# Altium schematic sheet Power.SchDoc
size A
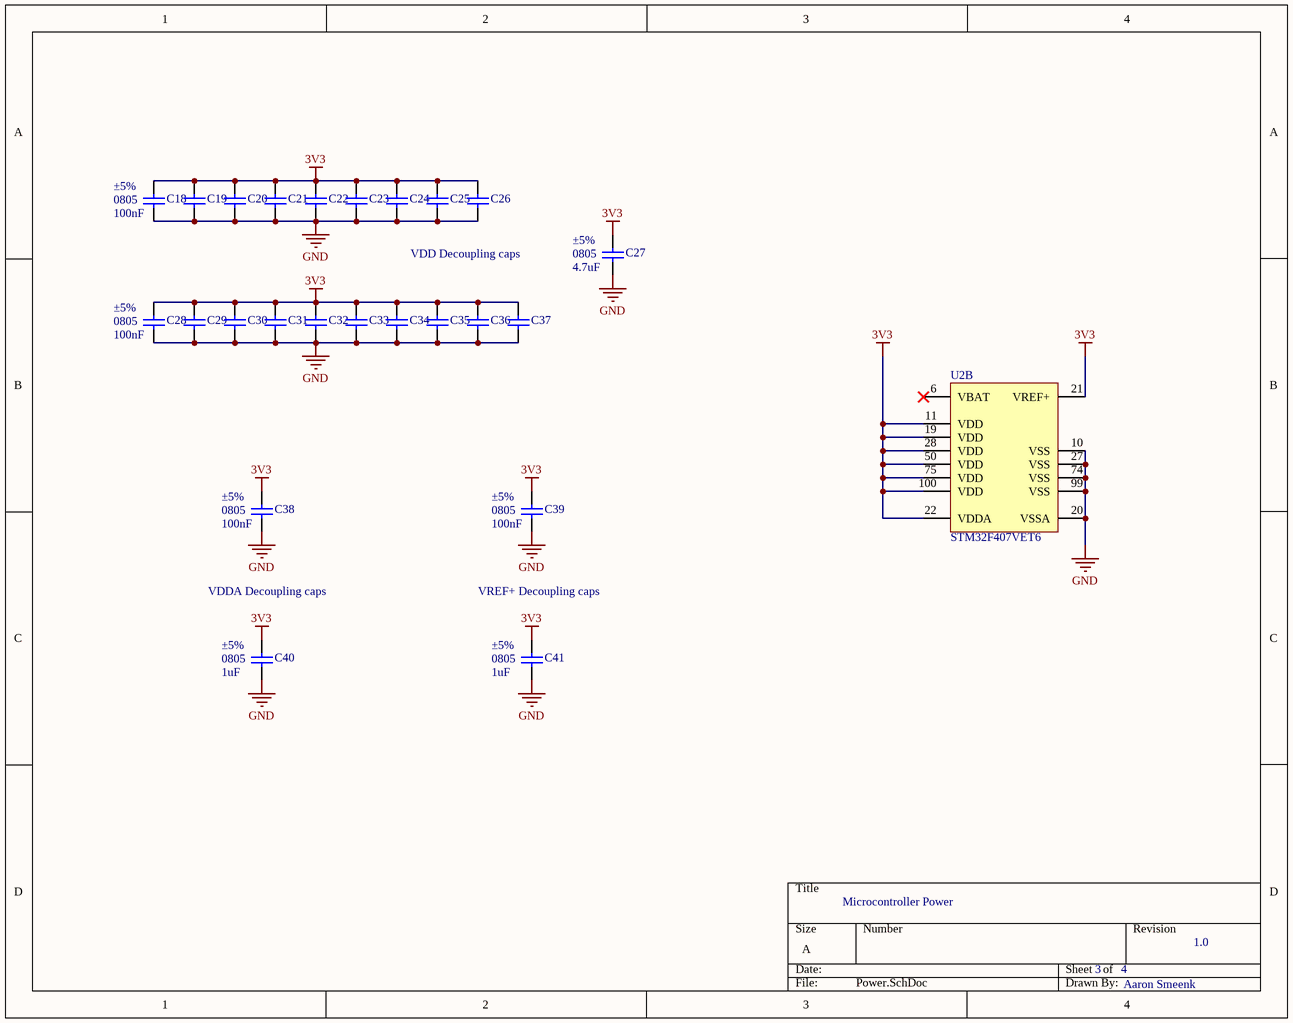
[diagram p0: Power.SchDoc]

## Parts
C18  value 100nF  Tolerance: ±5%  Case-EIA: 0805  [CAPC0805(2012)100_L]  (hidden comment: CAP 100nF 6.3V 0805(2012))
C19  CAP 100nF 6.3V 0805(2012)  [CAPC0805(2012)100_L]  (value not drawn)
C20  CAP 100nF 6.3V 0805(2012)  [CAPC0805(2012)100_L]  (value not drawn)
C21  CAP 100nF 6.3V 0805(2012)  [CAPC0805(2012)100_L]  (value not drawn)
C22  CAP 100nF 6.3V 0805(2012)  [CAPC0805(2012)100_L]  (value not drawn)
C23  CAP 100nF 6.3V 0805(2012)  [CAPC0805(2012)100_L]  (value not drawn)
C24  CAP 100nF 6.3V 0805(2012)  [CAPC0805(2012)100_L]  (value not drawn)
C25  CAP 100nF 6.3V 0805(2012)  [CAPC0805(2012)100_L]  (value not drawn)
C26  CAP 100nF 6.3V 0805(2012)  [CAPC0805(2012)100_L]  (value not drawn)
C27  value 4.7uF  Case-EIA: 0805  Tolerance: ±5%  [CAPC0805(2012)145_N]  (hidden comment: CAP 4.7uF 6.3V 0805(2012))
C28  value 100nF  Tolerance: ±5%  Case-EIA: 0805  [CAPC0805(2012)100_L]  (hidden comment: CAP 100nF 6.3V 0805(2012))
C29  CAP 100nF 6.3V 0805(2012)  [CAPC0805(2012)100_L]  (value not drawn)
C30  CAP 100nF 6.3V 0805(2012)  [CAPC0805(2012)100_L]  (value not drawn)
C31  CAP 100nF 6.3V 0805(2012)  [CAPC0805(2012)100_L]  (value not drawn)
C32  CAP 100nF 6.3V 0805(2012)  [CAPC0805(2012)100_L]  (value not drawn)
C33  CAP 100nF 6.3V 0805(2012)  [CAPC0805(2012)100_L]  (value not drawn)
C34  CAP 100nF 6.3V 0805(2012)  [CAPC0805(2012)100_L]  (value not drawn)
C35  CAP 100nF 6.3V 0805(2012)  [CAPC0805(2012)100_L]  (value not drawn)
C36  CAP 100nF 6.3V 0805(2012)  [CAPC0805(2012)100_L]  (value not drawn)
C37  CAP 100nF 6.3V 0805(2012)  [CAPC0805(2012)100_L]  (value not drawn)
C38  value 100nF  Tolerance: ±5%  Case-EIA: 0805  [CAPC0805(2012)100_L]  (hidden comment: CAP 100nF 6.3V 0805(2012))
C39  value 100nF  Tolerance: ±5%  Case-EIA: 0805  [CAPC0805(2012)100_L]  (hidden comment: CAP 100nF 6.3V 0805(2012))
C40  value 1uF  Case-EIA: 0805  Tolerance: ±5%  [CAPC0805(2012)145_N]  (hidden comment: CAP 1uF 6.3V 0805(2012))
C41  value 1uF  Case-EIA: 0805  Tolerance: ±5%  [CAPC0805(2012)145_N]  (hidden comment: CAP 1uF 6.3V 0805(2012))
U2  STM32F407VET6  [STM-LQFP100_M]  (part B of 2)

## Nets
3V3: C18.2 C19.2 C20.2 C21.2 C22.2 C23.2 C24.2 C25.2 C26.2 C27.2 C28.2 C29.2 C30.2 C31.2 C32.2 C33.2 C34.2 C35.2 C36.2 C37.2 C38.2 C39.2 C40.2 C41.2 U2.11(VDD) U2.19(VDD) U2.21(VREF+) U2.22(VDDA) U2.28(VDD) U2.50(VDD) U2.75(VDD) U2.100(VDD)
GND: C18.1 C19.1 C20.1 C21.1 C22.1 C23.1 C24.1 C25.1 C26.1 C27.1 C28.1 C29.1 C30.1 C31.1 C32.1 C33.1 C34.1 C35.1 C36.1 C37.1 C38.1 C39.1 C40.1 C41.1 U2.10(VSS) U2.20(VSSA) U2.27(VSS) U2.74(VSS) U2.99(VSS)

Not connected (* = marked no-connect by the designer): U2 6(VBAT)*

## Notes on the sheet
- VDD Decoupling caps
- VDDA Decoupling caps
- VREF+ Decoupling caps
- Microcontroller Power
- 3
- 4
- 1.0
- Aaron Smeenk

## Library data of the parts
C18 C28 C38 C39 = CMP-1036-04390-1: CAP 100nF 6.3V ±5% 0805 (2012 Metric) Thickness 1mm SMD; Case-Metric: 2012; Rated Voltage: 6.3 V; Technology: SMT; Max Thickness: 1 mm
C19-C26 C29-C37 = CMP-1036-04390-1: CAP 100nF 6.3V ±5% 0805 (2012 Metric) Thickness 1mm SMD; Case-Metric: 2012; Case-EIA: 0805; Tolerance: ±5%; Value: 100nF; Rated Voltage: 6.3 V; Technology: SMT; Max Thickness: 1 mm
C27 = CMP-1036-04781-1: CAP 4.7uF 6.3V ±5% 0805 (2012 Metric) Thickness 1.45mm SMD; Case-Metric: 2012; Rated Voltage: 6.3 V; Technology: SMT; Max Thickness: 1.45 mm
C40 C41 = CMP-1036-04781-1: CAP 1uF 6.3V ±5% 0805 (2012 Metric) Thickness 1.45mm SMD; Case-Metric: 2012; Rated Voltage: 6.3 V; Technology: SMT; Max Thickness: 1.45 mm
U2 = CMP-0243-00016-3: ARM Cortex-M4 32-bit MCU+FPU, 210 DMIPS, 512 kB Flash, 192 kB Internal RAM, 82 I/Os, 100-pin LQFP, -40 to 85 degC, Tray; Manufacturer: STMicroelectronics; Supply Voltage(Vcc) max (V): 3.6; Supply Voltage(Vcc) min (V): 1.8; I/Os (High Current): 82; FLASH Size (Prog) (kB): 512; Operating Frequency(F) (Processor speed) (MHz): 168; D/A Converter: 2x12-bit; Internal RAM Size (kB): 192; PackageReference: LQFP100; Core: ARM Cortex-M4; ComponentLink1URL: http://www.st.com/web/en/home.html; ComponentLink1Description: Manufacturer URL; DatasheetVersion: Rev. 4; Packing: Tray; Mounting Technology: Surface Mount; ComponentLink2Description: Datasheet; ComponentLink2URL: http://www.st.com/st-web-ui/static/active/en/resource/technical/document/datasheet/DM00037051.pdf; ComponentLink3Description: Package Specification; PartNumber: STM32F407VET6; PackageVersion: Rev. 1, 06/2013; PackageDescription: 100-Pin Low Profile Quad Flat Package, 14 x 14 mm Body, 0.5 mm Pitch; ComponentLink3URL: http://www.st.com/st-web-ui/static/active/en/resource/technical/document/data_brief/DM00071938.pdf; PartId: 1